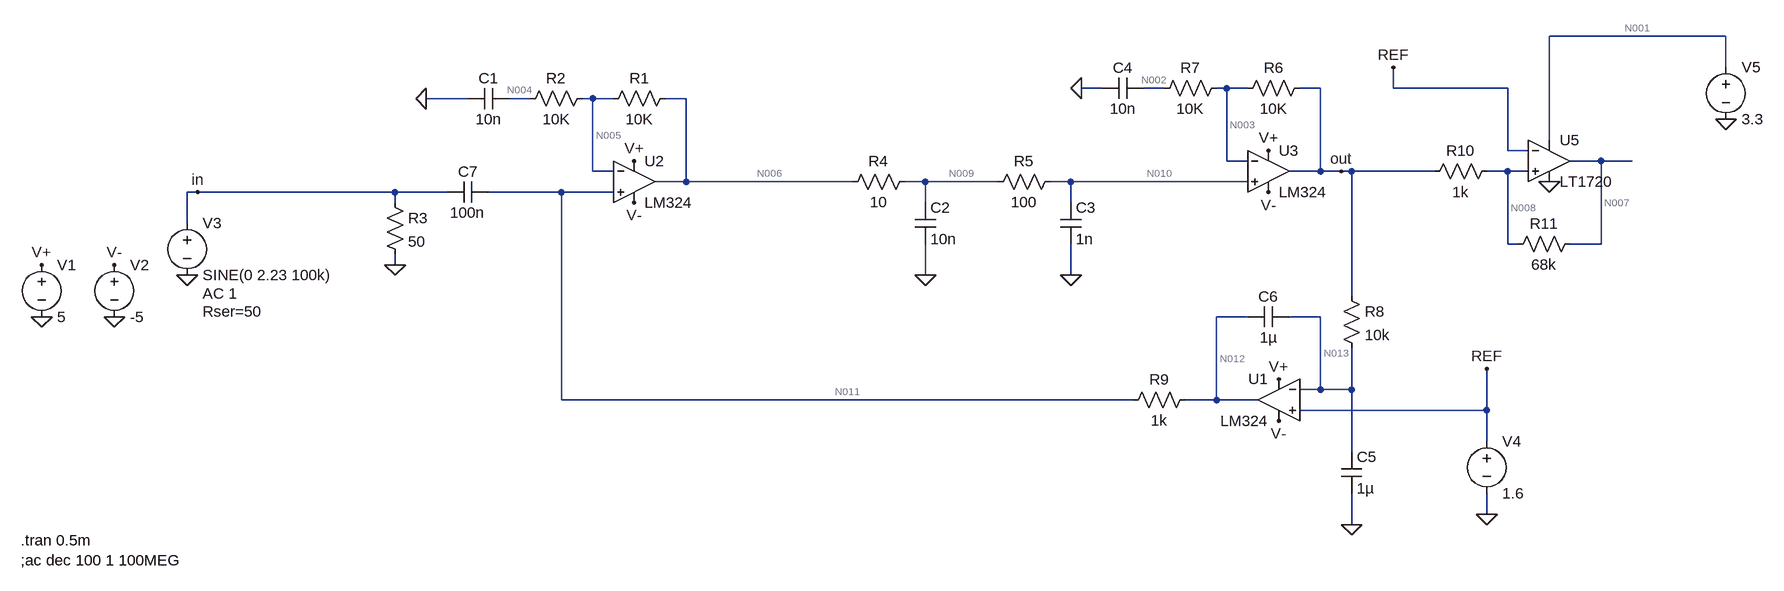
[diagram p0: schematic IF2 filter a amp.asc]
IF2 filter a amp.asc, the LTspice schematic file:
Version 4
SHEET 1 1856 852
WIRE 1792 32 1520 32
WIRE 1792 80 1792 32
WIRE 832 112 800 112
WIRE 928 112 896 112
WIRE 1024 112 1008 112
WIRE 1056 112 1024 112
WIRE 1168 112 1136 112
WIRE 1280 112 1280 80
WIRE 1456 112 1280 112
WIRE -144 128 -208 128
WIRE -48 128 -80 128
WIRE 48 128 32 128
WIRE 80 128 48 128
WIRE 192 128 160 128
WIRE 1520 192 1520 32
WIRE 1456 208 1456 112
WIRE 1488 208 1456 208
WIRE 1024 224 1024 112
WIRE 1056 224 1024 224
WIRE 1600 224 1552 224
WIRE 1648 224 1600 224
WIRE 48 240 48 128
WIRE 80 240 48 240
WIRE 1168 240 1168 112
WIRE 1168 240 1120 240
WIRE 1200 240 1168 240
WIRE 1216 240 1200 240
WIRE 1344 240 1216 240
WIRE 1456 240 1424 240
WIRE 1488 240 1456 240
WIRE 192 256 192 128
WIRE 192 256 144 256
WIRE 448 256 192 256
WIRE 560 256 528 256
WIRE 672 256 560 256
WIRE 784 256 752 256
WIRE 1056 256 784 256
WIRE -560 272 -576 272
WIRE -256 272 -560 272
WIRE -176 272 -256 272
WIRE 0 272 -112 272
WIRE 80 272 0 272
WIRE -256 288 -256 272
WIRE 560 288 560 256
WIRE 784 288 784 256
WIRE -576 320 -576 272
WIRE 1456 352 1456 240
WIRE 1472 352 1456 352
WIRE 1600 352 1600 224
WIRE 1600 352 1552 352
WIRE -256 384 -256 368
WIRE 560 400 560 352
WIRE 784 400 784 352
WIRE 1216 432 1216 240
WIRE 1056 464 1008 464
WIRE 1168 464 1120 464
WIRE 1168 576 1168 464
WIRE 1168 576 1136 576
WIRE 1216 576 1216 512
WIRE 1216 576 1168 576
WIRE 0 592 0 272
WIRE 880 592 0 592
WIRE 1008 592 1008 464
WIRE 1008 592 960 592
WIRE 1072 592 1008 592
WIRE 1424 608 1424 544
WIRE 1424 608 1136 608
WIRE 1424 656 1424 608
WIRE 1216 672 1216 576
WIRE 1424 768 1424 736
WIRE 1216 784 1216 736
FLAG -688 464 0
FLAG -800 464 0
FLAG 112 224 V+
FLAG -800 384 V+
FLAG -688 384 V-
FLAG 112 288 V-
FLAG -576 400 0
FLAG -256 384 0
FLAG 560 400 0
FLAG -560 272 in
FLAG 784 400 0
FLAG 1088 208 V+
FLAG 1088 272 V-
FLAG 800 112 0
FLAG 1200 240 out
FLAG 1424 768 0
FLAG -208 128 0
FLAG 1104 560 V+
FLAG 1104 624 V-
FLAG 1216 784 0
FLAG 1424 544 REF
FLAG 1280 80 REF
FLAG 1520 256 0
FLAG 1792 160 0
DATAFLAG 336 256 ""
DATAFLAG 912 256 ""
DATAFLAG 1168 144 ""
DATAFLAG 1200 576 ""
DATAFLAG 752 592 ""
DATAFLAG 1296 240 ""
DATAFLAG 1008 512 ""
SYMBOL voltage -800 368 R0
WINDOW 123 0 0 Left 0
WINDOW 39 0 0 Left 0
SYMATTR InstName V1
SYMATTR Value 5
SYMBOL voltage -688 368 R0
WINDOW 123 0 0 Left 0
WINDOW 39 0 0 Left 0
SYMATTR InstName V2
SYMATTR Value -5
SYMBOL voltage -576 304 R0
WINDOW 123 24 124 Left 2
WINDOW 39 24 152 Left 2
SYMATTR Value2 AC 1
SYMATTR SpiceLine Rser=50
SYMATTR InstName V3
SYMATTR Value SINE(0 2.23 100k)
SYMBOL res 176 112 R90
WINDOW 0 0 56 VBottom 2
WINDOW 3 32 56 VTop 2
SYMATTR InstName R1
SYMATTR Value 10K
SYMBOL res 48 112 R90
WINDOW 0 0 56 VBottom 2
WINDOW 3 32 56 VTop 2
SYMATTR InstName R2
SYMATTR Value 10K
SYMBOL res -272 272 R0
SYMATTR InstName R3
SYMATTR Value 50
SYMBOL res 544 240 R90
WINDOW 0 0 56 VBottom 2
WINDOW 3 32 56 VTop 2
SYMATTR InstName R4
SYMATTR Value 10
SYMBOL cap 544 288 R0
SYMATTR InstName C2
SYMATTR Value 10n
SYMBOL res 768 240 R90
WINDOW 0 0 56 VBottom 2
WINDOW 3 32 56 VTop 2
SYMATTR InstName R5
SYMATTR Value 100
SYMBOL cap 768 288 R0
SYMATTR InstName C3
SYMATTR Value 1n
SYMBOL res 1152 96 R90
WINDOW 0 0 56 VBottom 2
WINDOW 3 32 56 VTop 2
SYMATTR InstName R6
SYMATTR Value 10K
SYMBOL res 1024 96 R90
WINDOW 0 0 56 VBottom 2
WINDOW 3 32 56 VTop 2
SYMATTR InstName R7
SYMATTR Value 10K
SYMBOL cap 896 96 R90
WINDOW 0 0 32 VBottom 2
WINDOW 3 32 32 VTop 2
SYMATTR InstName C4
SYMATTR Value 10n
SYMBOL voltage 1424 640 R0
WINDOW 123 0 0 Left 0
WINDOW 39 0 0 Left 0
SYMATTR InstName V4
SYMATTR Value 1.6
SYMBOL Opamps\\LM324 112 192 R0
SYMATTR InstName U2
SYMBOL Opamps\\LM324 1088 176 R0
SYMATTR InstName U3
SYMBOL cap -80 112 R90
WINDOW 0 0 32 VBottom 2
WINDOW 3 32 32 VTop 2
SYMATTR InstName C1
SYMATTR Value 10n
SYMBOL Opamps\\LM324 1104 528 M0
SYMATTR InstName U1
SYMBOL cap 1200 672 R0
SYMATTR InstName C5
SYMATTR Value 1µ
SYMBOL res 1200 416 R0
SYMATTR InstName R8
SYMATTR Value 10k
SYMBOL res 976 576 R90
WINDOW 0 0 56 VBottom 2
WINDOW 3 32 56 VTop 2
SYMATTR InstName R9
SYMATTR Value 1k
SYMBOL cap 1120 448 R90
WINDOW 0 0 32 VBottom 2
WINDOW 3 32 32 VTop 2
SYMATTR InstName C6
SYMATTR Value 1µ
SYMBOL cap -112 256 R90
WINDOW 0 0 32 VBottom 2
WINDOW 3 32 32 VTop 2
SYMATTR InstName C7
SYMATTR Value 100n
SYMBOL Comparators\\LT1720 1520 160 R0
SYMATTR InstName U5
SYMBOL res 1440 224 R90
WINDOW 0 0 56 VBottom 2
WINDOW 3 32 56 VTop 2
SYMATTR InstName R10
SYMATTR Value 1k
SYMBOL res 1568 336 R90
WINDOW 0 0 56 VBottom 2
WINDOW 3 32 56 VTop 2
SYMATTR InstName R11
SYMATTR Value 68k
SYMBOL voltage 1792 64 R0
WINDOW 123 0 0 Left 0
WINDOW 39 0 0 Left 0
SYMATTR InstName V5
SYMATTR Value 3.3
TEXT -832 808 Left 2 !.tran 0.5m\n;ac dec 100 1 100MEG

The netlist it stands for:
* IF2 filter a amp.asc
V1 V+ 0 5
V2 V- 0 -5
V3 in 0 SINE(0 2.23 100k) AC 1 Rser=50
R1 N006 N005 10K
R2 N005 N004 10K
R3 in 0 50
R4 N009 N006 10
C2 N009 0 10n
R5 N010 N009 100
C3 N010 0 1n
R6 out N003 10K
R7 N003 N002 10K
C4 N002 0 10n
V4 REF 0 1.6
XU2 N011 N005 V+ V- N006 LM324  ; pins In+ In- V+ V- OUT
XU3 N010 N003 V+ V- out LM324  ; pins In+ In- V+ V- OUT
C1 N004 0 10n
XU1 REF N013 V+ V- N012 LM324  ; pins In+ In- V+ V- OUT
C5 N013 0 1µ
R8 out N013 10k
R9 N012 N011 1k
C6 N013 N012 1µ
C7 N011 in 100n
XU5 N008 REF N001 0 N007 LT1720  ; pins In+ In- V+ V- OUT
R10 N008 out 1k
R11 N007 N008 68k
V5 N001 0 3.3
.tran 0.5m
;ac dec 100 1 100MEG
.lib LT1720.sub
.backanno
.end

* Results of the author's LTspice run, read from the files saved beside the schematic
* Operating Point, zero values left out:
*   V(v+) = 5 V
*   V(v-) = -5 V
*   V(n006) = 1.6 V
*   V(n005) = 1.6 V
*   V(n004) = 1.6 V
*   V(n009) = 1.6 V
*   V(n010) = 1.6 V
*   V(out) = 1.6 V
*   V(n003) = 1.6 V
*   V(n002) = 1.6 V
*   V(ref) = 1.6 V
*   V(n011) = 1.6 V
*   V(n012) = 1.6 V
*   V(n013) = 1.6 V
*   V(n008) = 1.583 V
*   V(n001) = 3.3 V
*   V(n007) = 174 mV
*   I(R11) = -20.72 µA
*   I(R10) = -16.74 µA
*   I(R9) = -19.74 nA
*   I(R8) = -19.81 nA
*   I(R6) = -19.81 nA
*   I(R5) = 19.74 nA
*   I(R4) = 19.74 nA
*   I(R1) = -19.81 nA
*   I(V5) = -3.149 mA
*   I(V4) = 1.037 µA
*   I(V2) = 1.019 mA
*   I(V1) = -1.02 mA
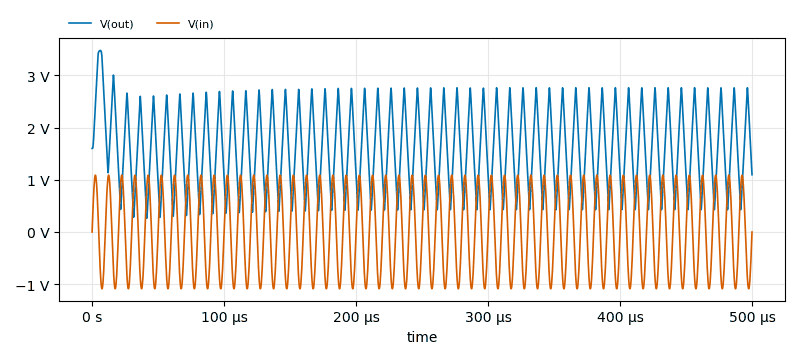
[diagram p1: Transient Analysis of IF2 filter a amp.asc, plotted from the saved traces]
* Transient Analysis, 1 run:
*   V(out): min 263.6 mV, max 3.477 V, average 1.602 V, rms 1.758 V, last 1.096 V
*   V(in): min -1.088 V, max 1.088 V, average 154.1 µV, rms 769.1 mV, last -531.1 µV